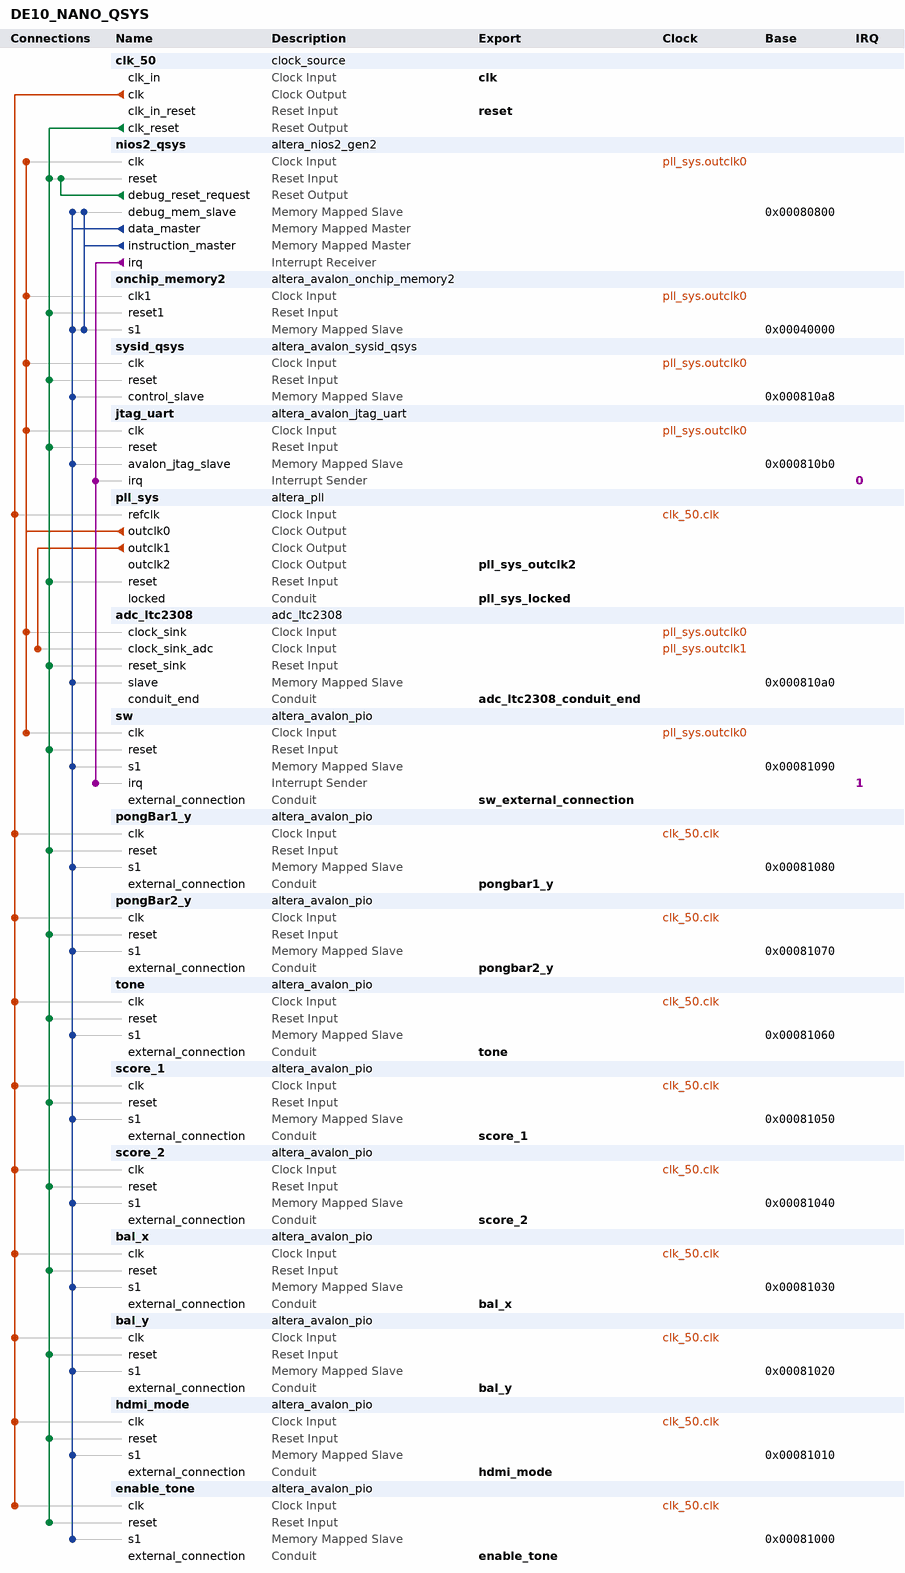
[diagram p0: system contents]
# Platform Designer (Qsys) system DE10_NANO_QSYS, Cyclone V 5CSEBA6U23I7
# Parameters at their usual value, and those the tool derives, are not listed.
package require -exact qsys 17.1
create_system DE10_NANO_QSYS
set_project_property DEVICE_FAMILY {Cyclone V}
set_project_property DEVICE 5CSEBA6U23I7

add_instance clk_50 clock_source 17.1
set_instance_parameter_value clk_50 clockFrequency 50000000

add_instance nios2_qsys altera_nios2_gen2 17.1
set_instance_parameter_value nios2_qsys dcache_size 2048
set_instance_parameter_value nios2_qsys exceptionSlave onchip_memory2.s1
set_instance_parameter_value nios2_qsys icache_size 4096
set_instance_parameter_value nios2_qsys impl Fast
set_instance_parameter_value nios2_qsys resetSlave onchip_memory2.s1
set_instance_parameter_value nios2_qsys setting_activateTrace true

add_instance onchip_memory2 altera_avalon_onchip_memory2 17.1
set_instance_parameter_value onchip_memory2 dataWidth 32
set_instance_parameter_value onchip_memory2 dualPort false
set_instance_parameter_value onchip_memory2 initMemContent true
set_instance_parameter_value onchip_memory2 initializationFileName onchip_mem.hex
set_instance_parameter_value onchip_memory2 memorySize 160000

add_instance sysid_qsys altera_avalon_sysid_qsys 17.1
set_instance_parameter_value sysid_qsys id 0

add_instance jtag_uart altera_avalon_jtag_uart 17.1
set_instance_parameter_value jtag_uart simInteractiveOptions NO_INTERACTIVE_WINDOWS

add_instance pll_sys altera_pll 17.1
set_instance_parameter_value pll_sys gui_device_speed_grade 2
set_instance_parameter_value pll_sys gui_number_of_clocks 3
set_instance_parameter_value pll_sys gui_operation_mode normal
set_instance_parameter_value pll_sys gui_output_clock_frequency0 100.0
set_instance_parameter_value pll_sys gui_output_clock_frequency1 40.0
set_instance_parameter_value pll_sys gui_output_clock_frequency2 200.0
set_instance_parameter_value pll_sys gui_pll_mode {Integer-N PLL}
set_instance_parameter_value pll_sys gui_reference_clock_frequency 50.0
set_instance_parameter_value pll_sys gui_use_locked true

add_instance adc_ltc2308 adc_ltc2308 1.1

add_instance sw altera_avalon_pio 17.1
set_instance_parameter_value sw captureEdge true
set_instance_parameter_value sw direction Input
set_instance_parameter_value sw edgeType ANY
set_instance_parameter_value sw generateIRQ true
set_instance_parameter_value sw irqType EDGE
set_instance_parameter_value sw width 10

add_instance pongBar1_y altera_avalon_pio 17.1
set_instance_parameter_value pongBar1_y direction Output
set_instance_parameter_value pongBar1_y width 16

add_instance pongBar2_y altera_avalon_pio 17.1
set_instance_parameter_value pongBar2_y direction Output
set_instance_parameter_value pongBar2_y width 16

add_instance tone altera_avalon_pio 17.1
set_instance_parameter_value tone direction Output
set_instance_parameter_value tone width 2

add_instance score_1 altera_avalon_pio 17.1
set_instance_parameter_value score_1 direction Output
set_instance_parameter_value score_1 width 8

add_instance score_2 altera_avalon_pio 17.1
set_instance_parameter_value score_2 direction Output
set_instance_parameter_value score_2 width 8

add_instance bal_x altera_avalon_pio 17.1
set_instance_parameter_value bal_x direction Output
set_instance_parameter_value bal_x width 16

add_instance bal_y altera_avalon_pio 17.1
set_instance_parameter_value bal_y direction Output
set_instance_parameter_value bal_y width 16

add_instance hdmi_mode altera_avalon_pio 17.1
set_instance_parameter_value hdmi_mode direction Input
set_instance_parameter_value hdmi_mode width 4

add_instance enable_tone altera_avalon_pio 17.1
set_instance_parameter_value enable_tone direction Output
set_instance_parameter_value enable_tone width 1

# connections
add_connection clk_50.clk bal_x.clk clock
add_connection clk_50.clk bal_y.clk clock
add_connection clk_50.clk enable_tone.clk clock
add_connection clk_50.clk hdmi_mode.clk clock
add_connection clk_50.clk pll_sys.refclk clock
add_connection clk_50.clk pongBar1_y.clk clock
add_connection clk_50.clk pongBar2_y.clk clock
add_connection clk_50.clk score_1.clk clock
add_connection clk_50.clk score_2.clk clock
add_connection clk_50.clk tone.clk clock
add_connection pll_sys.outclk0 adc_ltc2308.clock_sink clock
add_connection pll_sys.outclk0 jtag_uart.clk clock
add_connection pll_sys.outclk0 nios2_qsys.clk clock
add_connection pll_sys.outclk0 onchip_memory2.clk1 clock
add_connection pll_sys.outclk0 sw.clk clock
add_connection pll_sys.outclk0 sysid_qsys.clk clock
add_connection pll_sys.outclk1 adc_ltc2308.clock_sink_adc clock
add_connection clk_50.clk_reset adc_ltc2308.reset_sink reset
add_connection clk_50.clk_reset bal_x.reset reset
add_connection clk_50.clk_reset bal_y.reset reset
add_connection clk_50.clk_reset enable_tone.reset reset
add_connection clk_50.clk_reset hdmi_mode.reset reset
add_connection clk_50.clk_reset jtag_uart.reset reset
add_connection clk_50.clk_reset nios2_qsys.reset reset
add_connection clk_50.clk_reset onchip_memory2.reset1 reset
add_connection clk_50.clk_reset pll_sys.reset reset
add_connection clk_50.clk_reset pongBar1_y.reset reset
add_connection clk_50.clk_reset pongBar2_y.reset reset
add_connection clk_50.clk_reset score_1.reset reset
add_connection clk_50.clk_reset score_2.reset reset
add_connection clk_50.clk_reset sw.reset reset
add_connection clk_50.clk_reset sysid_qsys.reset reset
add_connection clk_50.clk_reset tone.reset reset
add_connection nios2_qsys.debug_reset_request nios2_qsys.reset reset
add_connection nios2_qsys.data_master adc_ltc2308.slave avalon
set_connection_parameter_value nios2_qsys.data_master/adc_ltc2308.slave baseAddress 0x000810a0
add_connection nios2_qsys.data_master bal_x.s1 avalon
set_connection_parameter_value nios2_qsys.data_master/bal_x.s1 baseAddress 0x00081030
add_connection nios2_qsys.data_master bal_y.s1 avalon
set_connection_parameter_value nios2_qsys.data_master/bal_y.s1 baseAddress 0x00081020
add_connection nios2_qsys.data_master enable_tone.s1 avalon
set_connection_parameter_value nios2_qsys.data_master/enable_tone.s1 baseAddress 0x00081000
add_connection nios2_qsys.data_master hdmi_mode.s1 avalon
set_connection_parameter_value nios2_qsys.data_master/hdmi_mode.s1 baseAddress 0x00081010
add_connection nios2_qsys.data_master jtag_uart.avalon_jtag_slave avalon
set_connection_parameter_value nios2_qsys.data_master/jtag_uart.avalon_jtag_slave baseAddress 0x000810b0
add_connection nios2_qsys.data_master nios2_qsys.debug_mem_slave avalon
set_connection_parameter_value nios2_qsys.data_master/nios2_qsys.debug_mem_slave baseAddress 0x00080800
add_connection nios2_qsys.data_master onchip_memory2.s1 avalon
set_connection_parameter_value nios2_qsys.data_master/onchip_memory2.s1 baseAddress 0x00040000
add_connection nios2_qsys.data_master pongBar1_y.s1 avalon
set_connection_parameter_value nios2_qsys.data_master/pongBar1_y.s1 baseAddress 0x00081080
add_connection nios2_qsys.data_master pongBar2_y.s1 avalon
set_connection_parameter_value nios2_qsys.data_master/pongBar2_y.s1 baseAddress 0x00081070
add_connection nios2_qsys.data_master score_1.s1 avalon
set_connection_parameter_value nios2_qsys.data_master/score_1.s1 baseAddress 0x00081050
add_connection nios2_qsys.data_master score_2.s1 avalon
set_connection_parameter_value nios2_qsys.data_master/score_2.s1 baseAddress 0x00081040
add_connection nios2_qsys.data_master sw.s1 avalon
set_connection_parameter_value nios2_qsys.data_master/sw.s1 baseAddress 0x00081090
add_connection nios2_qsys.data_master sysid_qsys.control_slave avalon
set_connection_parameter_value nios2_qsys.data_master/sysid_qsys.control_slave baseAddress 0x000810a8
add_connection nios2_qsys.data_master tone.s1 avalon
set_connection_parameter_value nios2_qsys.data_master/tone.s1 baseAddress 0x00081060
add_connection nios2_qsys.instruction_master nios2_qsys.debug_mem_slave avalon
set_connection_parameter_value nios2_qsys.instruction_master/nios2_qsys.debug_mem_slave baseAddress 0x00080800
add_connection nios2_qsys.instruction_master onchip_memory2.s1 avalon
set_connection_parameter_value nios2_qsys.instruction_master/onchip_memory2.s1 baseAddress 0x00040000
add_connection nios2_qsys.irq jtag_uart.irq interrupt
set_connection_parameter_value nios2_qsys.irq/jtag_uart.irq irqNumber 0
add_connection nios2_qsys.irq sw.irq interrupt
set_connection_parameter_value nios2_qsys.irq/sw.irq irqNumber 1

# exported interfaces
add_interface adc_ltc2308_conduit_end conduit end
set_interface_property adc_ltc2308_conduit_end EXPORT_OF adc_ltc2308.conduit_end
add_interface bal_x conduit end
set_interface_property bal_x EXPORT_OF bal_x.external_connection
add_interface bal_y conduit end
set_interface_property bal_y EXPORT_OF bal_y.external_connection
add_interface clk clock sink
set_interface_property clk EXPORT_OF clk_50.clk_in
add_interface enable_tone conduit end
set_interface_property enable_tone EXPORT_OF enable_tone.external_connection
add_interface hdmi_mode conduit end
set_interface_property hdmi_mode EXPORT_OF hdmi_mode.external_connection
add_interface pll_sys_locked conduit end
set_interface_property pll_sys_locked EXPORT_OF pll_sys.locked
add_interface pll_sys_outclk2 clock source
set_interface_property pll_sys_outclk2 EXPORT_OF pll_sys.outclk2
add_interface pongbar1_y conduit end
set_interface_property pongbar1_y EXPORT_OF pongBar1_y.external_connection
add_interface pongbar2_y conduit end
set_interface_property pongbar2_y EXPORT_OF pongBar2_y.external_connection
add_interface reset reset sink
set_interface_property reset EXPORT_OF clk_50.clk_in_reset
add_interface score_1 conduit end
set_interface_property score_1 EXPORT_OF score_1.external_connection
add_interface score_2 conduit end
set_interface_property score_2 EXPORT_OF score_2.external_connection
add_interface sw_external_connection conduit end
set_interface_property sw_external_connection EXPORT_OF sw.external_connection
add_interface tone conduit end
set_interface_property tone EXPORT_OF tone.external_connection

set_interconnect_requirement {$system} qsys_mm.clockCrossingAdapter HANDSHAKE
set_interconnect_requirement {$system} qsys_mm.maxAdditionalLatency 1

save_system DE10_NANO_QSYS.qsys
